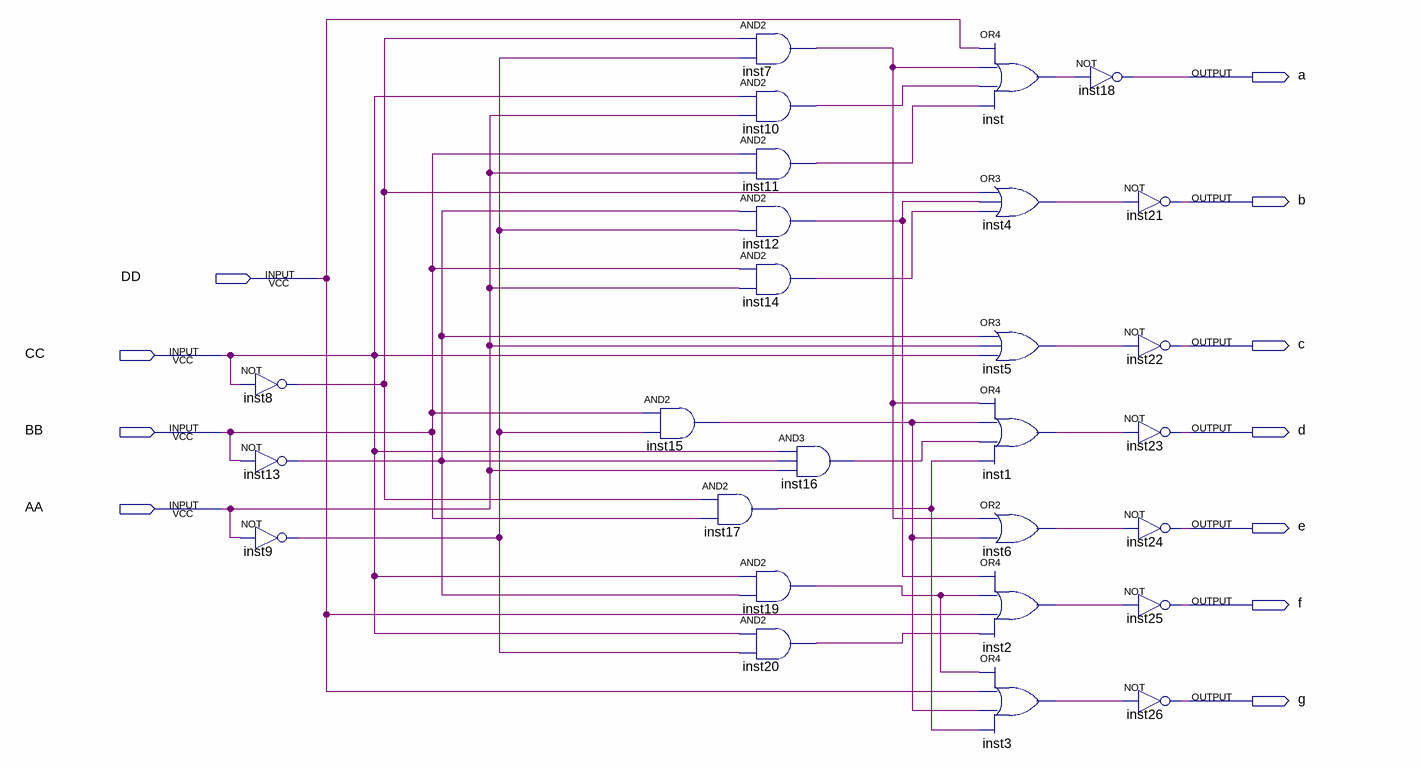
[diagram p0: schematic sheet]
// Quartus schematic BDC7SEG.bdf as structural Verilog: 27 symbols, 11 pins
module BDC7SEG (
  input  DD,
  input  CC,
  input  BB,
  input  AA,
  output a,
  output b,
  output c,
  output d,
  output e,
  output f,
  output g
);

  wire inst1_out, inst2_out, inst3_out, inst4_out, inst5_out, inst6_out, inst7_out, inst8_out, inst9_out,
       inst10_out, inst11_out, inst12_out, inst13_out, inst14_out, inst15_out, inst16_out, inst17_out,
       inst19_out, inst20_out, inst_out;

  not inst8 (inst8_out, CC);
  not inst13 (inst13_out, BB);
  not inst9 (inst9_out, AA);
  and inst15 (inst15_out, BB, inst9_out);
  and inst17 (inst17_out, inst8_out, BB);
  and inst7 (inst7_out, inst8_out, inst9_out);
  and inst10 (inst10_out, CC, AA);
  and inst11 (inst11_out, BB, AA);
  and inst12 (inst12_out, inst13_out, inst9_out);
  and inst14 (inst14_out, BB, AA);
  and inst16 (inst16_out, CC, inst13_out, AA);
  and inst19 (inst19_out, CC, inst13_out);
  and inst20 (inst20_out, CC, inst9_out);
  or inst (inst_out, DD, inst7_out, inst10_out, inst11_out);
  or inst4 (inst4_out, inst8_out, inst12_out, inst14_out);
  or inst5 (inst5_out, inst13_out, AA, CC);
  or inst1 (inst1_out, inst7_out, inst15_out, inst16_out, inst17_out);
  or inst6 (inst6_out, inst7_out, inst15_out);
  or inst2 (inst2_out, inst12_out, inst19_out, DD, inst20_out);
  or inst3 (inst3_out, inst19_out, DD, inst15_out, inst17_out);
  not inst18 (a, inst_out);
  not inst21 (b, inst4_out);
  not inst22 (c, inst5_out);
  not inst23 (d, inst1_out);
  not inst24 (e, inst6_out);
  not inst25 (f, inst2_out);
  not inst26 (g, inst3_out);
endmodule
